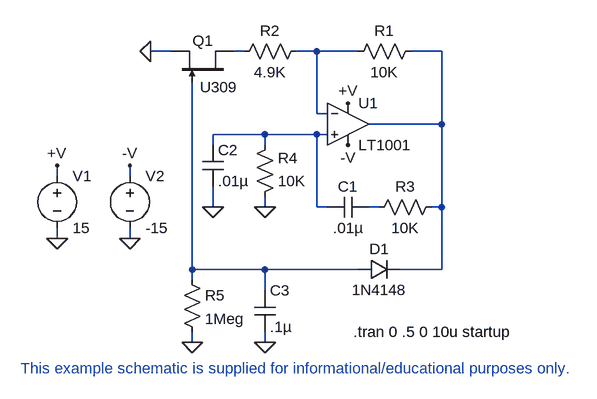
[diagram p0: schematic Wien.asc]
Wien.asc, the LTspice schematic file:
Version 4
SHEET 1 880 1108
WIRE -112 128 -144 128
WIRE 0 128 -16 128
WIRE 112 128 80 128
WIRE 176 128 112 128
WIRE 304 128 256 128
WIRE 112 224 112 128
WIRE 128 224 112 224
WIRE 304 240 304 128
WIRE 304 240 192 240
WIRE 32 256 -48 256
WIRE 112 256 32 256
WIRE 128 256 112 256
WIRE -48 272 -48 256
WIRE 32 272 32 256
WIRE -288 320 -288 304
WIRE -176 320 -176 304
WIRE -48 368 -48 336
WIRE 32 368 32 352
WIRE 112 368 112 256
WIRE 128 368 112 368
WIRE 208 368 192 368
WIRE 304 368 304 240
WIRE 304 368 288 368
WIRE -288 416 -288 400
WIRE -176 416 -176 400
WIRE -80 464 -80 176
WIRE 32 464 -80 464
WIRE 176 464 32 464
WIRE 304 464 304 368
WIRE 304 464 240 464
WIRE -80 480 -80 464
WIRE 32 496 32 464
WIRE -80 576 -80 560
WIRE 32 576 32 560
FLAG 160 208 +V
FLAG 160 272 -V
FLAG -288 304 +V
FLAG -176 416 0
FLAG -288 416 0
FLAG -176 304 -V
FLAG 32 368 0
FLAG -48 368 0
FLAG -144 128 0
FLAG 32 576 0
FLAG -80 576 0
SYMBOL voltage -288 304 R0
SYMATTR InstName V1
SYMATTR Value 15
SYMBOL voltage -176 304 R0
SYMATTR InstName V2
SYMATTR Value -15
SYMBOL res 272 112 R90
WINDOW 0 0 56 VBottom 0
WINDOW 3 32 56 VTop 0
SYMATTR InstName R1
SYMATTR Value 10K
SYMBOL res 96 112 R90
WINDOW 0 0 56 VBottom 0
WINDOW 3 32 56 VTop 0
SYMATTR InstName R2
SYMATTR Value 4.9K
SYMBOL res 304 352 R90
WINDOW 0 0 56 VBottom 0
WINDOW 3 32 56 VTop 0
SYMATTR InstName R3
SYMATTR Value 10K
SYMBOL res 16 368 M180
WINDOW 0 36 76 Left 0
WINDOW 3 36 40 Left 0
SYMATTR InstName R4
SYMATTR Value 10K
SYMBOL cap 192 352 R90
WINDOW 0 0 32 VBottom 0
WINDOW 3 32 32 VTop 0
SYMATTR InstName C1
SYMATTR Value .01µ
SYMBOL cap -64 272 R0
SYMATTR InstName C2
SYMATTR Value .01µ
SYMBOL njf -16 176 M270
WINDOW 0 49 47 VTop 0
WINDOW 3 -7 52 VLeft 0
SYMATTR InstName Q1
SYMATTR Value U309
SYMBOL diode 176 448 M90
WINDOW 0 0 32 VBottom 0
WINDOW 3 32 32 VTop 0
SYMATTR InstName D1
SYMATTR Value 1N4148
SYMBOL res -96 464 R0
SYMATTR InstName R5
SYMATTR Value 1Meg
SYMBOL cap 16 560 M180
WINDOW 0 24 64 Left 0
WINDOW 3 24 8 Left 0
SYMATTR InstName C3
SYMATTR Value .1µ
SYMBOL opamps\\LT1001 160 176 R0
SYMATTR InstName U1
TEXT 168 560 Left 0 !.tran 0 .5 0 10u startup
TEXT -344 616 Left 0 ;This example schematic is supplied for informational/educational purposes only.

The netlist it stands for:
* Wien.asc
V1 +V 0 15
V2 -V 0 -15
R1 N003 N002 10K
R2 N002 N001 4.9K
R3 N003 N005 10K
R4 0 N004 10K
C1 N005 N004 .01µ
C2 N004 0 .01µ
J§Q1 N001 N006 0 U309
D1 N006 N003 1N4148
R5 N006 0 1Meg
C3 0 N006 .1µ
XU1 N004 N002 +V -V N003 LT1001  ; pins In+ In- V+ V- OUT
.model D D
.lib standard.dio
.model NJF NJF
.model PJF PJF
.lib standard.jft
.tran 0 .5 0 10u startup
* This example schematic is supplied for informational/educational purposes only.
.lib LTC.lib
.backanno
.end